# Altium schematic sheet Teensy 3.6 with J1939 - Handheld Rev3d.SchDoc: Secure CAN Logger
size Letter; Organization: Dr. Jeremy Daily; Address1: Systems Engineering; Address2: Engineering A202; Address3: Fort Collins , CO 80523; Address4: www.engr.colostate.edu/se/; DocumentNumber: External Connections; Revision: 3d; SheetNumber: 1; SheetTotal: 3
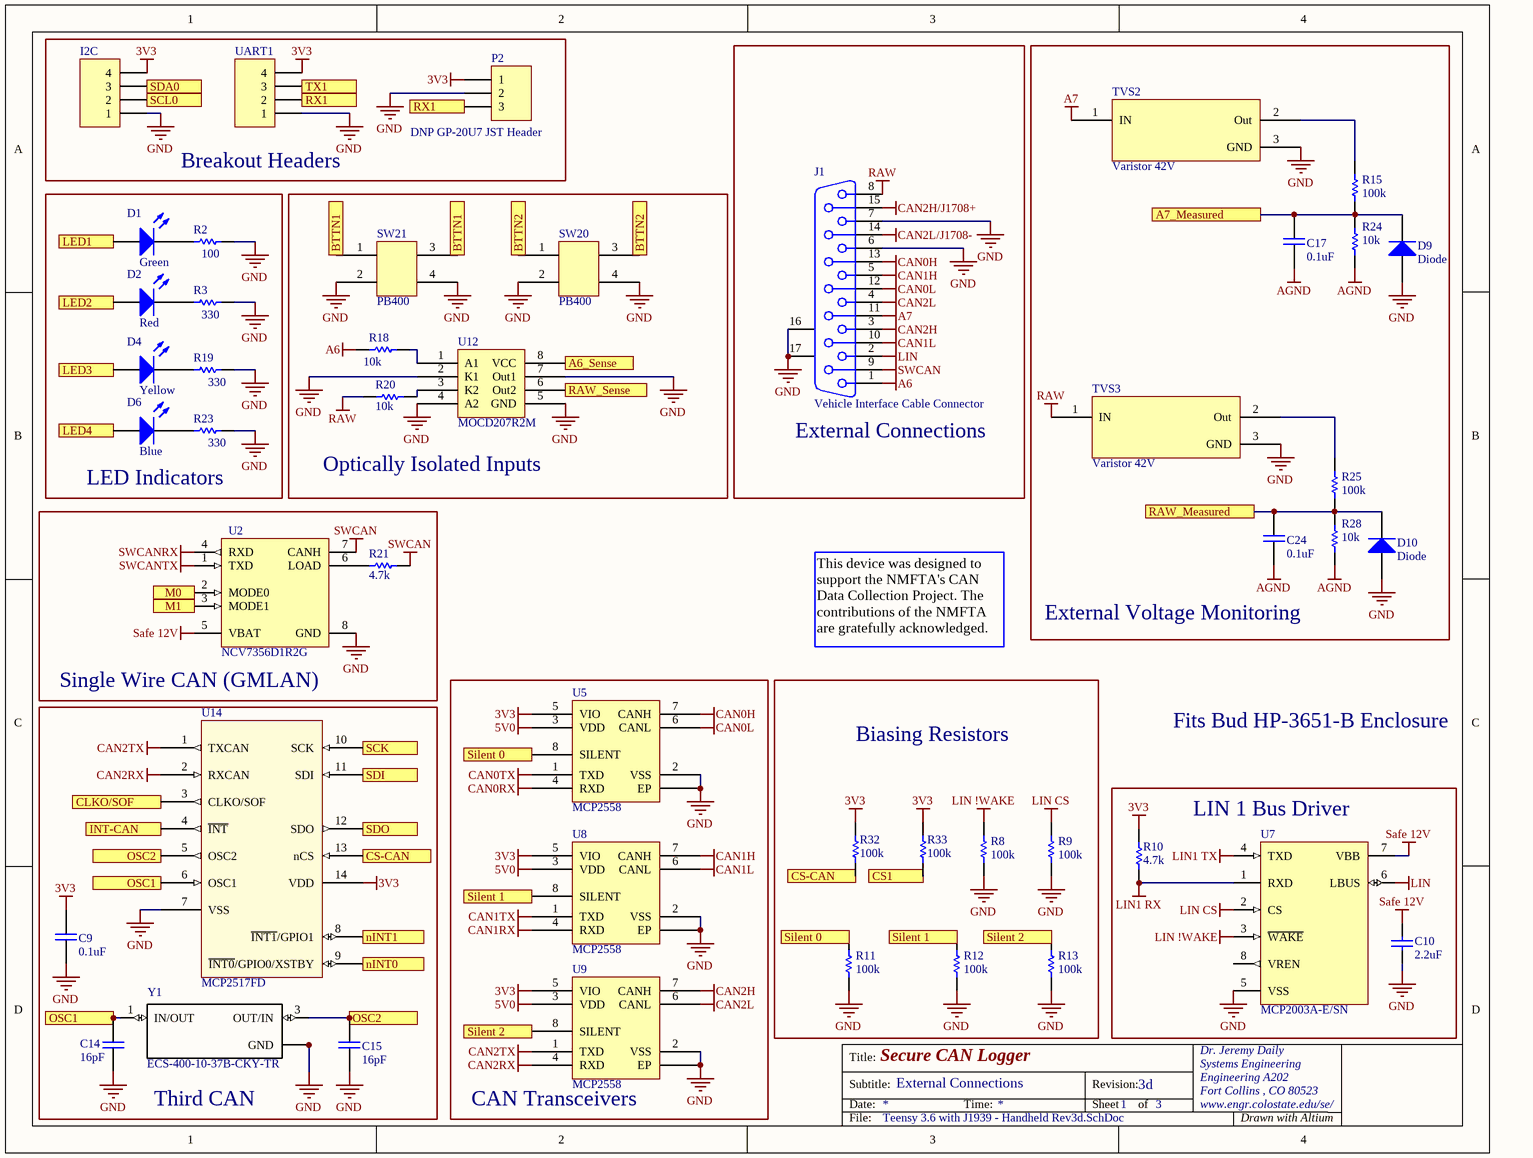
[diagram p0: Teensy 3.6 with J1939 - Handheld Rev3d.SchDoc]

## Parts
C9  0.1uF  [0603]
C10  2.2uF  [0603]
C14  16pF  [0603]
C15  16pF  [0603]
C17  0.1uF  [0603]
C24  0.1uF  [0603]
D1  Green  [0805 Polarized]
D2  Red  [0805 Polarized]
D4  Yellow  [0805 Polarized]
D6  Blue  [0805 Polarized]
D9  Diode  [CST2C]
D10  Diode  [CST2C]
I2C  Header 4  [HDR1X4]  (value not drawn)
J1  Vehicle Interface Cable Connector  [DSUB1.385-2H15]
P2  DNP GP-20U7 JST Header  [MHDR1X3]
R2  100  [0603]
R3  330  [0603]
R8  100k  [0603]
R9  100k  [0603]
R10  4.7k  [0603]
R11  100k  [0603]
R12  100k  [0603]
R13  100k  [0603]
R15  100k  [0603]
R18  10k  [0603]
R19  330  [0603]
R20  10k  [0603]
R21  4.7k  [0603]
R23  330  [0603]
R24  10k  [0603]
R25  100k  [0603]
R28  10k  [0603]
R32  100k  [0603]
R33  100k  [0603]
SW20  PB400  [PB400]
SW21  PB400  [PB400]
TVS2  Varistor 42V  [Transfeed]
TVS3  Varistor 42V  [Transfeed]
U2  NCV7356D1R2G  [ONSC-SOIC-8-751-07_V]
U5  MCP2558  [TDFN]
U7  MCP2003A-E/SN  [SOIC-SN8_N]
U8  MCP2558  [TDFN]
U9  MCP2558  [TDFN]
U12  MOCD207R2M  [SOIC-8]
U14  MCP2517FD  [SOP14]
UART1  Header 4  [HDR1X4]  (value not drawn)
Y1  ECS-400-10-37B-CKY-TR  [*XTAL_ECS-160-9-37-CKM-TR]

## Blocks framed on the sheet
Breakout Headers: I2C P2 UART1
External Connections: J1
External Voltage Monitoring: C17 C24 D9 D10 R15 R24 R25 R28 TVS2 TVS3
LED Indicators: D1 D2 D4 D6 R2 R3 R19 R23
Optically Isolated Inputs: R18 R20 SW20 SW21 U12
Single Wire CAN (GMLAN): R21 U2
CAN Transceivers: U5 U8 U9
Biasing Resistors: R8 R9 R11-R13 R32 R33
Third CAN: C9 C14 C15 U14 Y1
LIN 1 Bus Driver: C10 R10 U7

## Ports
A6_Sense, A7_Measured, BTTN1, BTTN2, CLKO/SOF, CS1, CS-CAN, INT-CAN, LED1, LED2, LED3, LED4, M0, M1, nINT0, nINT1, OSC1, OSC2, RAW_Measured, RAW_Sense, RX1, SCK, SCL0, SDA0, SDI, SDO, Silent 0, Silent 1, Silent 2, TX1

## Nets
3V3: C9.2 I2C.4 P2.1 R10.2 R32.2 R33.2 U5.5(VIO) U8.5(VIO) U9.5(VIO) U14.14(VDD) UART1.4
5V0: U5.3(VDD) U8.3(VDD) U9.3(VDD)
A6: J1.1 R18.1
A7: J1.11 TVS2.1(IN)
AGND: C17.1 C24.1 R24.2 R28.2
CAN0H: J1.13 U5.7(CANH)
CAN0L: J1.12 U5.6(CANL)
CAN0RX: U5.4(RXD)
CAN0TX: U5.1(TXD)
CAN1H: J1.5 U8.7(CANH)
CAN1L: J1.10 U8.6(CANL)
CAN1RX: U8.4(RXD)
CAN1TX: U8.1(TXD)
CAN2H: J1.3 U9.7(CANH)
CAN2H/J1708+: J1.15
CAN2L: J1.4 U9.6(CANL)
CAN2L/J1708-: J1.14
CAN2RX: U9.4(RXD) U14.2(RXCAN)
CAN2TX: U9.1(TXD) U14.1(TXCAN)
GND: C9.1 C10.2 C14.1 C15.1 D9.1(A) D10.1(A) I2C.1 J1.6 J1.7 J1.16(MH1) J1.17(MH2) P2.2 R2.2 R3.2 R8.2 R9.2 R11.2 R12.2 R13.2 R19.2 R23.2 SW20.2 SW20.4 SW21.2 SW21.4 TVS2.3(GND) TVS3.3(GND) U2.8(GND) U5.0(EP) U5.2(VSS) U7.5(VSS) U8.0(EP) U8.2(VSS) U9.0(EP) U9.2(VSS) U12.2(K1) U12.4(A2) U12.5(GND) U12.7(Out1) U14.7(VSS) UART1.1 Y1.2(GND) Y1.4(GND)
LIN: J1.2 U7.6(LBUS)
LIN1 RX: R10.1 U7.1(RXD)
LIN1 TX: U7.4(TXD)
LIN !WAKE: R8.1 U7.3(~{WAKE})
LIN CS: R9.1 U7.2(CS)
RAW: J1.8 R20.1 TVS3.1(IN)
Safe 12V: C10.1 U2.5(VBAT) U7.7(VBB)
SWCAN: J1.9 R21.2 U2.7(CANH)
SWCANRX: U2.4(RXD)
SWCANTX: U2.1(TXD)
A6_Sense: U12.8(VCC) ; port A6_Sense
A7_Measured: C17.2 D9.2(K) R15.2 R24.1 ; port A7_Measured
BTTN1: SW21.1 SW21.3 ; port BTTN1
BTTN2: SW20.1 SW20.3 ; port BTTN2
CLKO/SOF: U14.3(CLKO/SOF) ; port CLKO/SOF
CS1: R33.1 ; port CS1
CS-CAN: R32.1 U14.13(nCS) ; port CS-CAN
INT-CAN: U14.4(~{INT}) ; port INT-CAN
LED1: D1.1(A) ; port LED1
LED2: D2.1(A) ; port LED2
LED3: D4.1(A) ; port LED3
LED4: D6.1(A) ; port LED4
M0: U2.2(MODE0) ; port M0
M1: U2.3(MODE1) ; port M1
nINT0: U14.9(~{INT0}/GPIO0/XSTBY) ; port nINT0
nINT1: U14.8(~{INT1}/GPIO1) ; port nINT1
OSC1: C14.2 U14.6(OSC1) Y1.1(IN/OUT) ; port OSC1
OSC2: C15.2 U14.5(OSC2) Y1.3(OUT/IN) ; port OSC2
RAW_Measured: C24.2 D10.2(K) R25.2 R28.1 ; port RAW_Measured
RAW_Sense: U12.6(Out2) ; port RAW_Sense
RX1: P2.3 UART1.2 ; port RX1
SCK: U14.10(SCK) ; port SCK
SCL0: I2C.2 ; port SCL0
SDA0: I2C.3 ; port SDA0
SDI: U14.11(SDI) ; port SDI
SDO: U14.12(SDO) ; port SDO
Silent 0: R11.1 U5.8(SILENT) ; port Silent 0
Silent 1: R12.1 U8.8(SILENT) ; port Silent 1
Silent 2: R13.1 U9.8(SILENT) ; port Silent 2
TX1: UART1.3 ; port TX1
NetD1_2: D1.2(K) R2.1
NetD2_2: D2.2(K) R3.1
NetD4_2: D4.2(K) R19.1
NetD6_2: D6.2(K) R23.1
NetR15_1: R15.1 TVS2.2(Out)
NetR18_2: R18.2 U12.1(A1)
NetR20_2: R20.2 U12.3(K2)
NetR21_1: R21.1 U2.6(LOAD)
NetR25_1: R25.1 TVS3.2(Out)

Not connected (* = marked no-connect by the designer): U7 8(VREN)

## Notes on the sheet
- This device was designed to support the NMFTA's CAN Data Collection Project. The contributions of the NMFTA are gratefully acknowledged.
- Fits Bud HP-3651-B Enclosure
- Title:
- Subtitle:
- Date:
- Time:
- Revision:
- Sheet
- of
- File:
- Drawn with Altium

## Library data of the parts
C9 C17 C24 = Cap: CAP CER 0.1UF 50V X7R 0603; Manufacturer: KEMET; PartNumber: C0603C104K5RACAUTO; Alternative: Acceptable; Supplier 1: Digi-Key; Supplier Part Number 1: 399-6856-1-ND
C10 = Cap: 2.2µF ±10% 6.3V Ceramic Capacitor X5R 0603 (1608 Metric); Manufacturer: Taiyo Yuden; PartNumber: JMK107BJ225KAHT; Alternative: Acceptable; Supplier 1: Digi-Key; Supplier Part Number 1: 587-3386-1-ND
C14 C15 = Cap: 16pF ±5% 50V Ceramic Capacitor C0G, NP0 0603 (1608 Metric); Manufacturer: Yageo; PartNumber: CC0603JRNPO9BN160; Alternative: Acceptable; Supplier 1: Digi-Key; Supplier Part Number 1: 311-3964-1-ND
D1 = LED - SMD: Green 570nm LED Indication - Discrete 2.2V 0805 (2012 Metric); Manufacturer: OSRAM Opto Semiconductors Inc.; PartNumber: LG R971-KN-1; Supplier 1: Digi-Key; Supplier Part Number 1: 475-1410-1-ND
D2 = LED - SMD: Red 633nm LED Indication - Discrete 2V 0805 (2012 Metric); Manufacturer: OSRAM Opto Semiconductors Inc.; PartNumber: LS R976-NR-1; Supplier 1: Digi-Key; Supplier Part Number 1: 475-1278-1-ND
D4 = LED - SMD: LED YELLOW DIFFUSED 0805 SMD; Manufacturer: OSRAM Opto Semiconductors Inc.; PartNumber: LY R976-PS-36; Supplier 1: Digi-Key; Supplier Part Number 1: 475-2560-1-ND
D6 = LED - SMD: Blue 470nm LED Indication - Discrete 3.3V 0805 (2012 Metric); Manufacturer: Broadcom Limited; PartNumber: HSMN-C170; Supplier 1: Digi-Key; Supplier Part Number 1: 516-1437-1-ND
D9 D10 = Diode: Default Diode; Manufacturer: Toshiba Semiconductor and Storage; PartNumber: CCS15S30L3FCT-ND; Supplier 1: Digi-Key; Supplier Part Number 1: CCS15S30L3FCT-ND
I2C UART1 = Header 4: Header, 4-Pin
J1 = D Connector 15: Receptacle Assembly, 15 Position, Right Angle; Manufacturer: Amphenol FCI; PartNumber: D15S33E4GV00LF; Supplier 1: Digi-Key; Supplier Part Number 1: 609-1498-ND
P2 = MHDR1X3: CONN HEADER PH SIDE 3POS 2MM SMD; PartNumber: S3B-PH-SM4-TB(LF)(SN); Manufacturer: JST; Supplier 1: Digi-Key; Supplier Part Number 1: 455-1750-1-ND
R2 = Chip Resistor: 100 Ohms ±1% 0.1W, 1/10W Chip Resistor 0603 (1608 Metric) Automotive AEC-Q200, High Voltage Thick Film; Manufacturer: Rohm Semiconductor; PartNumber: KTR03EZPF1000; Alternative: Acceptable; Supplier 1: Digi-Key; Supplier Part Number 1: RHM100AYCT-ND
R3 R19 R23 = Chip Resistor: 330 Ohms ±1% 0.1W, 1/10W Chip Resistor 0603 (1608 Metric) Automotive AEC-Q200, High Voltage Thick Film; Manufacturer: Rohm Semiconductor; PartNumber: KTR03EZPF3300; Alternative: Acceptable; Supplier 1: Digi-Key; Supplier Part Number 1: RHM330AYCT-ND
R8 R9 R11-R13 R15 R25 R32 R33 = Chip Resistor: 100 kOhms ±1% 0.1W, 1/10W Chip Resistor 0603 (1608 Metric) Automotive AEC-Q200, High Voltage Thick Film; Manufacturer: Rohm Semiconductor; PartNumber: KTR03EZPF1003; Alternative: Acceptable; Supplier 1: Digi-Key; Supplier Part Number 1: RHM100KAYCT-ND
R10 R21 = Chip Resistor: 4.7 kOhms ±1% 0.1W, 1/10W Chip Resistor 0603 (1608 Metric) Automotive AEC-Q200, High Voltage Thick Film; Manufacturer: Rohm Semiconductor; PartNumber: KTR03EZPF4701; Alternative: Acceptable; Supplier 1: Digi-Key; Supplier Part Number 1: RHM4.7KAYCT-ND
R18 R20 R24 R28 = Chip Resistor: 10 kOhms ±1% 0.1W, 1/10W Chip Resistor 0603 (1608 Metric) Automotive AEC-Q200, High Voltage Thick Film; Manufacturer: Rohm Semiconductor; PartNumber: KTR03EZPF1002; Alternative: Acceptable; Supplier 1: Digi-Key; Supplier Part Number 1: RHM10.0KAYCT-ND
SW20 SW21 = PB400: Pushbutton Switch DPST-NO Standard Through Hole, Right Angle; Manufacturer: E-Switch; PartNumber: PB400OAQR1BLK; Supplier 1: Digi-Key; Supplier Part Number 1: EG5548-ND
TVS2 TVS3 = Transfeed: VARISTOR CAP FEEDTHRU 18V 0805; Manufacturer: AVX; PartNumber: V2F118A400Y2EDP; Supplier 1: Digi-Key; Supplier Part Number 1: 478-2485-1-ND
U2 = NCV7356D1G: Single Wire CAN Transceiver, 5 to 27 V, 8-Pin SOIC, Pb-Free, Tube; Manufacturer: On Semiconductor; Supplier 1: Digi-Key; Supplier Part Number 1: NCV7356D1R2GOSCT-ND; PartNumber: NCV7356D1R2G
U5 = MCP2558FD: Microchip CAN FD Transceiver with Silent Mode; Manufacturer: Microchip Technology; PartNumber: MCP2558FDT-H/MNY; Supplier 1: Digi-Key; Supplier Part Number 1: MCP2558FDT-H/MNYCT-ND
U7 = MCP2003AT-E/SN: LIN J2602 Transceiver, 8-Pin SOIC, Extended Temperature, Tape and Reel; Manufacturer: Microchip Technology; Supplier 1: Digi-Key; Supplier Part Number 1: MCP2003A-E/SN-ND; PartNumber: MCP2003A-E/SN
U8 U9 = MCP2558FD: Microchip CAN FD Transceiver with Silent Mode; PartNumber: MCP2558FDT-H/MNY; Manufacturer: Microchip; Supplier 1: Digi-Key; Supplier Part Number 1: MCP2558FDT-H/MNYCT-ND
U12 = Optoisolator - Dual: Optoisolator Transistor Output 2500Vrms 2 Channel 8-SO Tall; Manufacturer: Fairchild/ON Semiconductor; PartNumber: MOCD207R2M; Supplier 1: Digi-Key; Supplier Part Number 1: MOCD207R2MCT-ND
U14 = MCP2517FD: CANbus Controller CAN 2.0 SPI Interface 14-VDFN (4.5x3); Manufacturer: Microchip Technology; PartNumber: MCP2517FDT-H/JHA; Supplier 1: Digi-Key; Supplier Part Number 1: MCP2517FDT-H/JHACT-ND
Y1 = ECS-400-10-37B-CKY-TR: SnapEDA_Link: https://www.snapeda.com/parts/ECS-400-10-37B-CKY-TR/ECS%20Inc./view-part/3655904/?ref=snap; BuyPart: https://www.snapeda.com/parts/ECS-400-10-37B-CKY-TR/ECS%20Inc./view-part/3655904/?ref=eda; Value: *